# EAGLE schematic DCO (EAGLE 6.5.0)
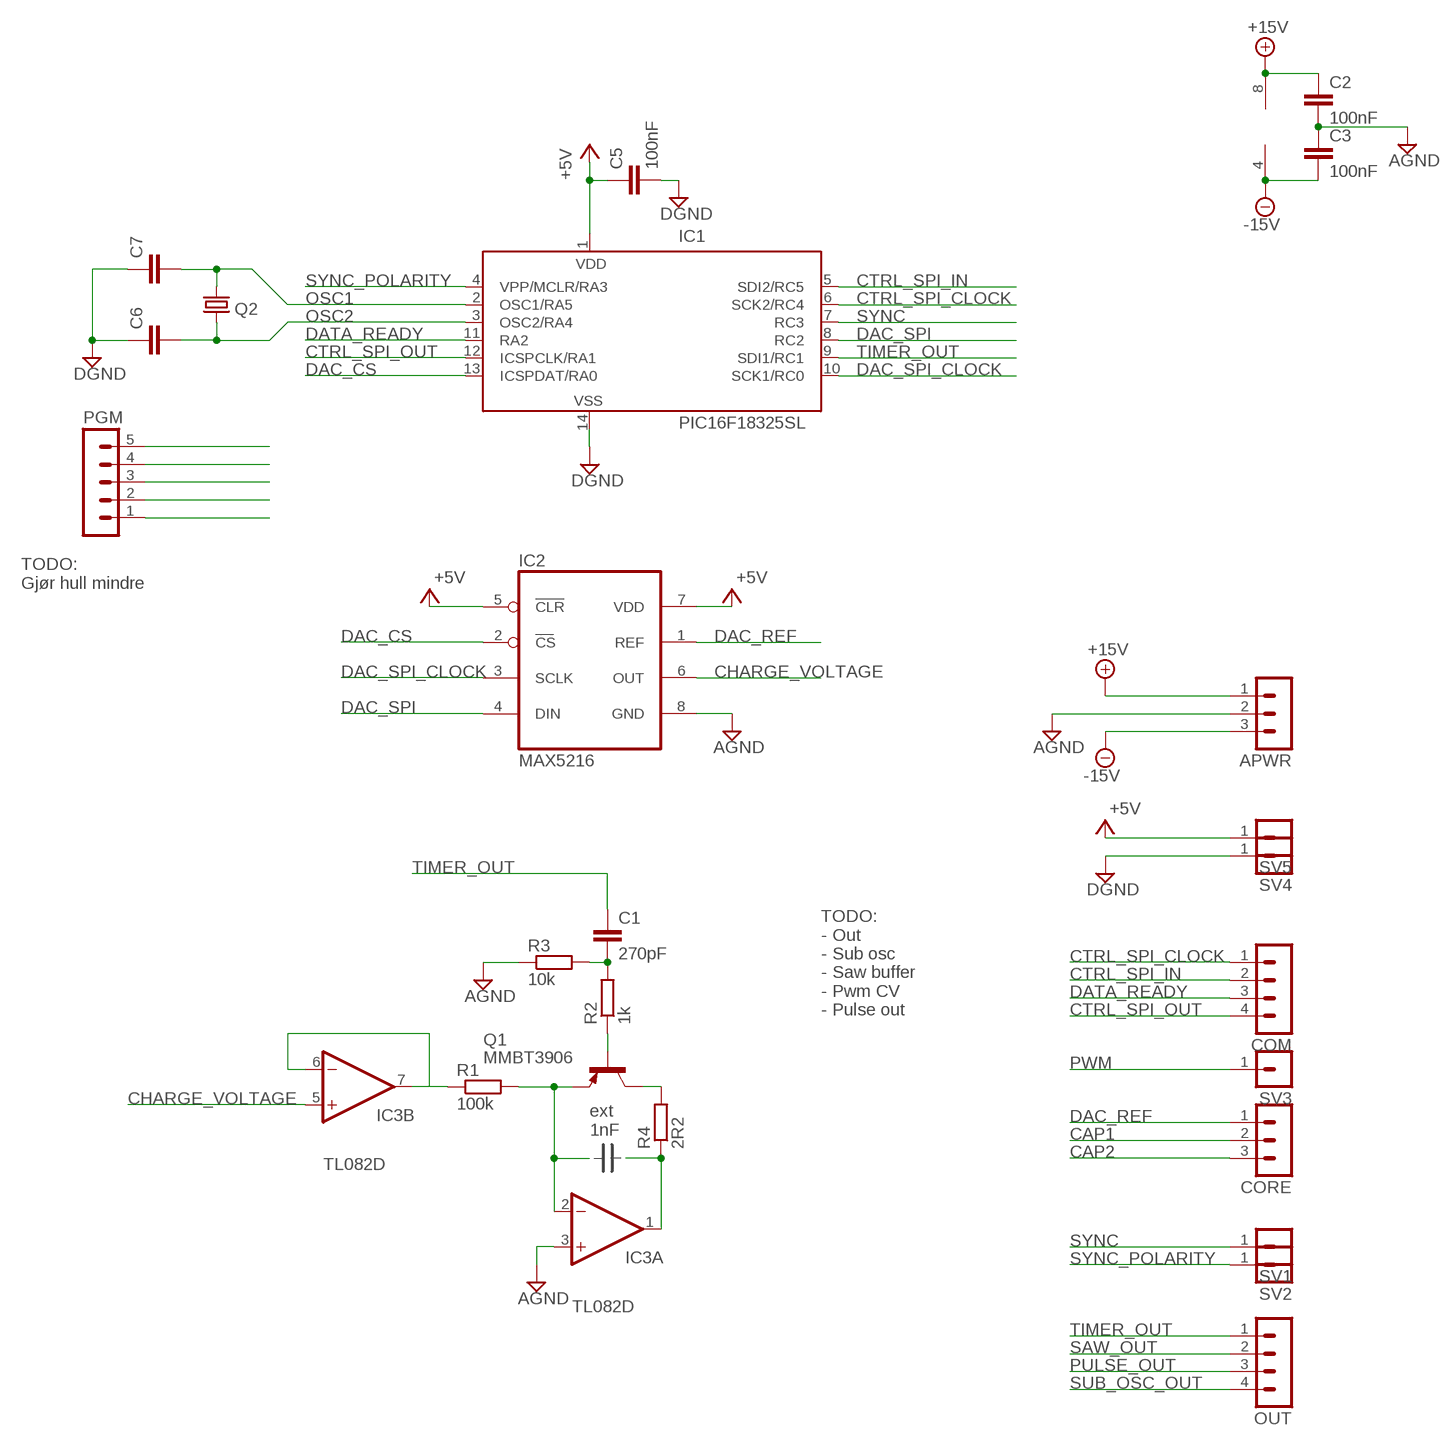
[diagram p0: schematic, sheet 1]

## Parts
APWR  MA03-1J  [MA03-1J]
C1  270pF  C-EUC0805  [C0805]
C2  100nF  C-EUC0805  [C0805]
C3  100nF  C-EUC0805  [C0805]
C5  100nF  C-EUC0805  [C0805]
C6  C-EUC0805  [C0805]
C7  C-EUC0805  [C0805]
COM  MA04-1J  [MA04-1J]
CORE  MA03-1J  [MA03-1J]
IC1  PIC16F18325SL  [SO14J]
IC2  MAX5216  [UMAX8J]
IC3  TL082D  [SO08]
OUT  MA04-1J  [MA04-1J]
PGM  MA05-1J  [MA05-1J]
Q1  MMBT3906  MMBT3906LT1SMD  [SOT23-BEC]
Q2  CRYSTALHC49S  [HC49/S]
R1  100k  R-EU_R0805  [R0805]
R2  1k  R-EU_R0805  [R0805]
R3  10k  R-EU_R0805  [R0805]
R4  2R2  R-EU_R0805  [R0805]
SV1  MA01-1J  [MA01-1J]
SV2  MA01-1J  [MA01-1J]
SV3  MA01-1J  [MA01-1J]
SV4  MA01-1J  [MA01-1J]
SV5  MA01-1J  [MA01-1J]

## Nets
+5V: C5.1 IC1.1(VDD) IC2.5(CLR) IC2.7(VDD) SV5.1
+15V: APWR.1 C2.1 IC3.8(P:V+)
-15V: APWR.3 C3.2 IC3.4(P:V-)
AGND: APWR.2 C2.2 C3.1 IC2.8(GND) IC3.3(A:+IN) R3.1
CAP1: CORE.2 IC3.2(A:-IN) Q1.E R1.2
CAP2: CORE.3 IC3.1(A:OUT) R4.1
CHARGE_VOLTAGE: IC2.6(OUT) IC3.5(B:+IN)
CTRL_SPI_CLOCK: COM.1 IC1.6(SCK2/RC4)
CTRL_SPI_IN: COM.2 IC1.5(SDI2/RC5)
CTRL_SPI_OUT: COM.4 IC1.12(ICSPCLK/RA1)
DAC_CS: IC1.13(ICSPDAT/RA0) IC2.2(CS)
DAC_REF: CORE.1 IC2.1(REF)
DAC_SPI: IC1.8(RC2) IC2.4(DIN)
DAC_SPI_CLOCK: IC1.10(SCK1/RC0) IC2.3(SCLK)
DATA_READY: COM.3 IC1.11(RA2)
DGND: C5.2 C6.1 C7.1 IC1.14(VSS) SV4.1
N$2: Q1.B R2.1
N$3: Q1.C R4.2
N$4: C1.2 R2.2 R3.2
N$5: PGM.1
N$6: PGM.2
N$7: PGM.3
N$8: PGM.4
N$9: PGM.5
N$10: IC3.6(B:-IN) IC3.7(B:OUT) R1.1
OSC1: C7.2 IC1.2(OSC1/RA5) Q2.2
OSC2: C6.2 IC1.3(OSC2/RA4) Q2.1
PULSE_OUT: OUT.3
PWM: SV3.1
SAW_OUT: OUT.2
SUB_OSC_OUT: OUT.4
SYNC: IC1.7(RC3) SV1.1
SYNC_POLARITY: IC1.4(VPP/MCLR/RA3) SV2.1
TIMER_OUT: C1.1 IC1.9(SDI1/RC1) OUT.1

## Notes on the sheet
- TODO: 
  Gjør hull mindre
- TODO: 
  - Out
  - Sub osc
  - Saw buffer
  - Pwm CV
  - Pulse out
- ext
  1nF

## Library data of the parts
APWR CORE = joakim:MA03-1J: PIN HEADER; OC_FARNELL: unknown; OC_NEWARK: unknown
C1-C3 C5-C7 = resistor:C-EU: CAPACITOR, European symbol
COM OUT = joakim:MA04-1J: PIN HEADER; OC_FARNELL: unknown; OC_NEWARK: unknown
IC1 = joakim:PIC16F18325: 14-Pin, Flash-Based 8-Bit CMOS Microcontroller; MF: MICROCHIP; MPN: PIC16F676-I/SL; OC_FARNELL: 9760520; OC_NEWARK: 92C4557
IC2 = joakim:MAX5216: DIGITAL/ANALOG CONVERTER Covers MAX5214 (14 bit), MAX5216 (16 bit)
IC3 = linear:TL082: OP AMP
PGM = joakim:MA05-1J: PIN HEADER; OC_FARNELL: unknown; OC_NEWARK: unknown
Q1 = transistor-pnp:MMBT3906*: PNP Transistror
Q2 = crystal:CRYSTAL: CRYSTAL; OC_FARNELL: 1667008; OC_NEWARK: unknown
R1-R4 = resistor:R-EU_: RESISTOR, European symbol
SV1-SV5 = joakim:MA01-1J: PIN HEADER